# EAGLE schematic improvedThermoCoupleADC (EAGLE 9.6.2)
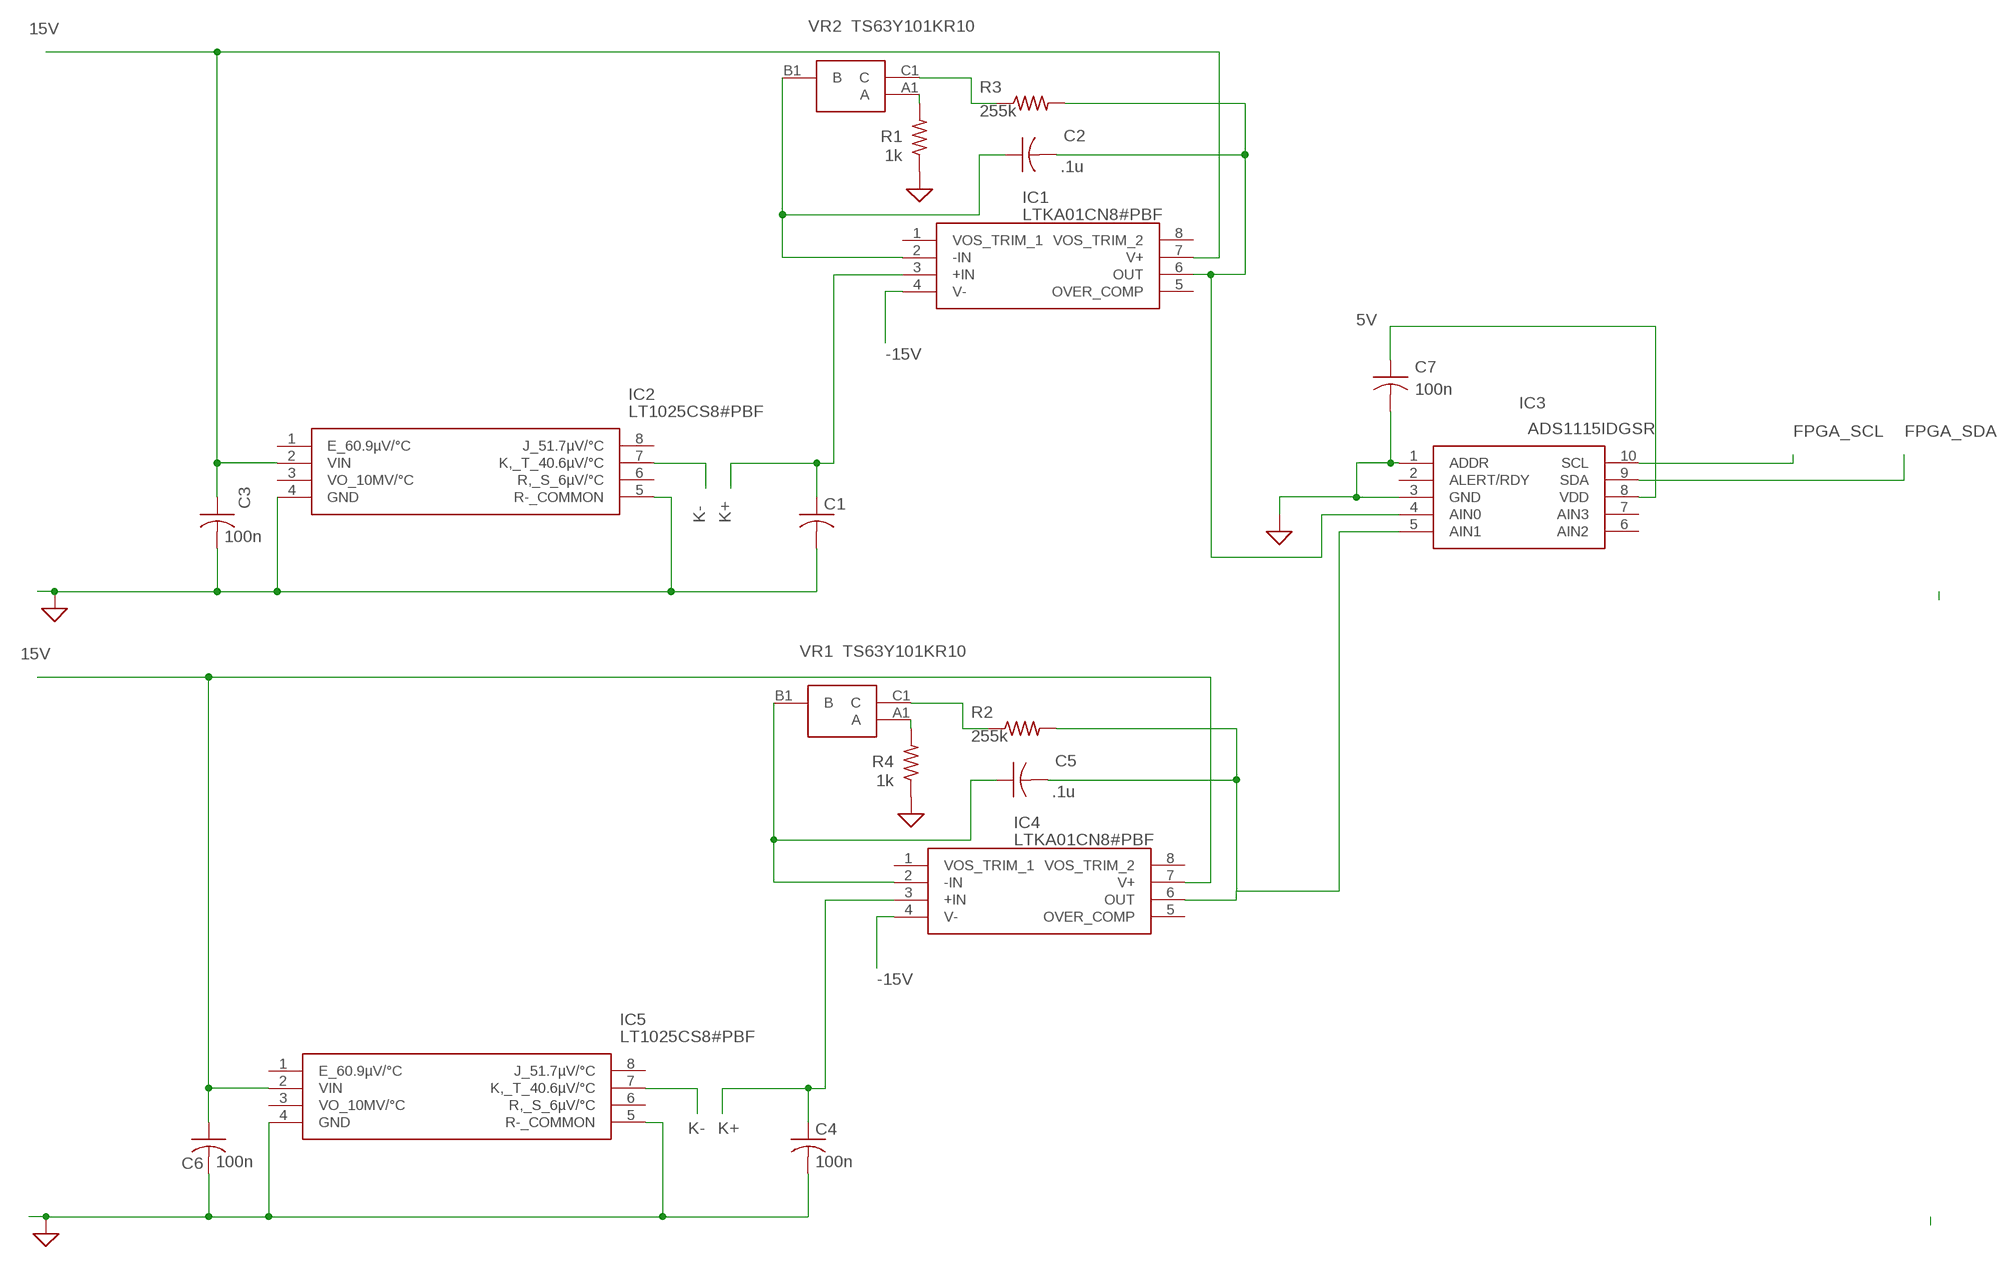
[diagram p0: schematic, sheet 1]

## Parts
C1  C-USC0805  [C0805]
C2  .1u  C-USC0805  [C0805]
C3  100n  C-USC0805  [C0805]
C4  100n  C-USC0805  [C0805]
C5  .1u  C-USC0805  [C0805]
C6  100n  C-USC0805  [C0805]
C7  100n  C-USC0805  [C0805]
IC1  LTKA01CN8#PBF  [DIP794W53P254L1016H394Q8N]
IC2  LT1025CS8#PBF  [SOIC127P599X175-8N]
IC3  ADS1115IDGSR  [SOP50P490X110-10N]
IC4  LTKA01CN8#PBF  [DIP794W53P254L1016H394Q8N]
IC5  LT1025CS8#PBF  [SOIC127P599X175-8N]
R1  1k  R-US_R0805  [R0805]
R2  255k  R-US_R0805  [R0805]
R3  255k  R-US_R0805  [R0805]
R4  1k  R-US_R0805  [R0805]
VR1  TS63Y101KR10  [TS63Y203KR10]
VR2  TS63Y101KR10  [TS63Y203KR10]

## Nets
5V: C7.1 IC3.8(VDD)
15V: C3.1 C6.1 IC1.7(V+) IC2.2(VIN) IC4.7(V+) IC5.2(VIN)
-15V: IC1.4(V-) IC4.4(V-)
FPGA_SCL: IC3.10(SCL)
FPGA_SDA: IC3.9(SDA)
GND: C1.2 C3.2 C4.2 C6.2 C7.2 IC2.4(GND) IC2.5(R-_COMMON) IC3.1(ADDR) IC3.3(GND) IC5.4(GND) IC5.5(R-_COMMON) R1.1 R4.1 ; supply symbol labelled SUP
K+: C1.1 C4.1 IC1.3(+IN) IC4.3(+IN)
K-: IC2.7(K,_T_40.6µV/°C) IC5.7(K,_T_40.6µV/°C)
N$2: C2.1 IC1.2(-IN) VR2.B1(B)
N$3: C2.2 IC1.6(OUT) IC3.4(AIN0) R3.2
N$4: C5.1 IC4.2(-IN) VR1.B1(B)
N$5: R1.2 VR2.A1(A)
N$6: R3.1 VR2.C1(C)
N$7: C5.2 IC3.5(AIN1) IC4.6(OUT) R2.2
N$8: R4.2 VR1.A1(A)
N$9: R2.1 VR1.C1(C)
Unconnected: IC1.1(VOS_TRIM_1) IC1.5(OVER_COMP) IC1.8(VOS_TRIM_2) IC2.1(E_60.9µV/°C) IC2.3(VO_10MV/°C) IC2.6(R,_S_6µV/°C) IC2.8(J_51.7µV/°C) IC3.2(ALERT/RDY) IC3.6(AIN2) IC3.7(AIN3) IC4.1(VOS_TRIM_1) IC4.5(OVER_COMP) IC4.8(VOS_TRIM_2) IC5.1(E_60.9µV/°C) IC5.3(VO_10MV/°C) IC5.6(R,_S_6µV/°C) IC5.8(J_51.7µV/°C)

## Library data of the parts
C1-C7 = rcl:C-US: CAPACITOR, American symbol; SPICEPREFIX: C
IC1 IC4 = LTKA01CN8#PBF:LTKA01CN8#PBF: Board Mount Temperature Sensors T.C. Amplifier ("1" Polarity) Source: Datasheet <https://www.analog.com/media/en/technical-documentation/data-sheets/ltk001fa.pdf>; ARROW_PART_NUMBER: LTKA01CN8#PBF; ARROW_PRICE-STOCK: https://www.arrow.com/en/products/ltka01cn8pbf/analog-devices; DESCRIPTION: Board Mount Temperature Sensors T.C. Amplifier ("1" Polarity); HEIGHT: 3.937mm; MANUFACTURER_NAME: Analog Devices; MANUFACTURER_PART_NUMBER: LTKA01CN8#PBF; MOUSER_PART_NUMBER: 584-LTKA01CN8#PBF; MOUSER_PRICE-STOCK: https://www.mouser.co.uk/ProductDetail/Analog-Devices/LTKA01CN8PBF?qs=hVkxg5c3xu9ZLXJNgCOg%2Fg%3D%3D
IC2 IC5 = LT1025CS8#PBF:LT1025CS8#PBF: LINEAR TECHNOLOGY - LT1025CS8#PBF - , , +/- 0.5C, 0 C, +70 C, SOIC, 8 Source: Datasheet <https://componentsearchengine.com/Datasheets/2/LT1025CS8#PBF.pdf>; ARROW_PART_NUMBER: LT1025CS8#PBF; ARROW_PRICE-STOCK: https://www.arrow.com/en/products/lt1025cs8pbf/linear-technology; DESCRIPTION: LINEAR TECHNOLOGY - LT1025CS8#PBF - , , +/- 0.5C, 0 C, +70 C, SOIC, 8; HEIGHT: 1.752mm; MANUFACTURER_NAME: Linear Technology; MANUFACTURER_PART_NUMBER: LT1025CS8#PBF; MOUSER_PART_NUMBER: 584-LT1025CS8#PBF; MOUSER_PRICE-STOCK: https://www.mouser.co.uk/ProductDetail/Analog-Devices-Linear-Technology/LT1025CS8PBF?qs=ytflclh7QUVFTkxgoaF%252Bog%3D%3D
IC3 = SamacSys_Parts:ADS1115IDGSR: 16-Bit 860SPS 4-Ch Delta-Sigma ADC With PGA, Oscillator, Vref, Comparator, and I2C Source: Datasheet <http://www.ti.com/lit/gpn/ADS1115>; DESCRIPTION: 16-Bit 860SPS 4-Ch Delta-Sigma ADC With PGA, Oscillator, Vref, Comparator, and I2C; HEIGHT: 1.1mm; MANUFACTURER_NAME: Texas Instruments; MANUFACTURER_PART_NUMBER: ADS1115IDGSR; MOUSER_PART_NUMBER: 595-ADS1115IDGSR; MOUSER_PRICE-STOCK: https://www.mouser.co.uk/ProductDetail/Texas-Instruments/ADS1115IDGSR?qs=IK5e5L0zOXjKCJoVMhYO%2FQ%3D%3D
R1-R4 = rcl:R-US_: RESISTOR, American symbol; SPICEPREFIX: R
VR1 VR2 = SamacSys_Parts:TS63Y101KR10: Trimmer Resistors - SMD 100 10% 1/4"SQU SMT MULTITURN Source: Datasheet <https://www.vishay.com/docs/51011/ts63.pdf>; DESCRIPTION: Trimmer Resistors - SMD 100 10% 1/4"SQU SMT MULTITURN; HEIGHT: 8mm; MANUFACTURER_NAME: Vishay; MANUFACTURER_PART_NUMBER: TS63Y101KR10; MOUSER_PART_NUMBER: 72-TS63Y101KR10; MOUSER_PRICE-STOCK: https://www.mouser.co.uk/ProductDetail/Vishay-Sfernice/TS63Y101KR10/?qs=MsRaK5qBadRoNMj1SnBycg%3D%3D